# EAGLE schematic IR Thermometer (EAGLE 7.6.0)
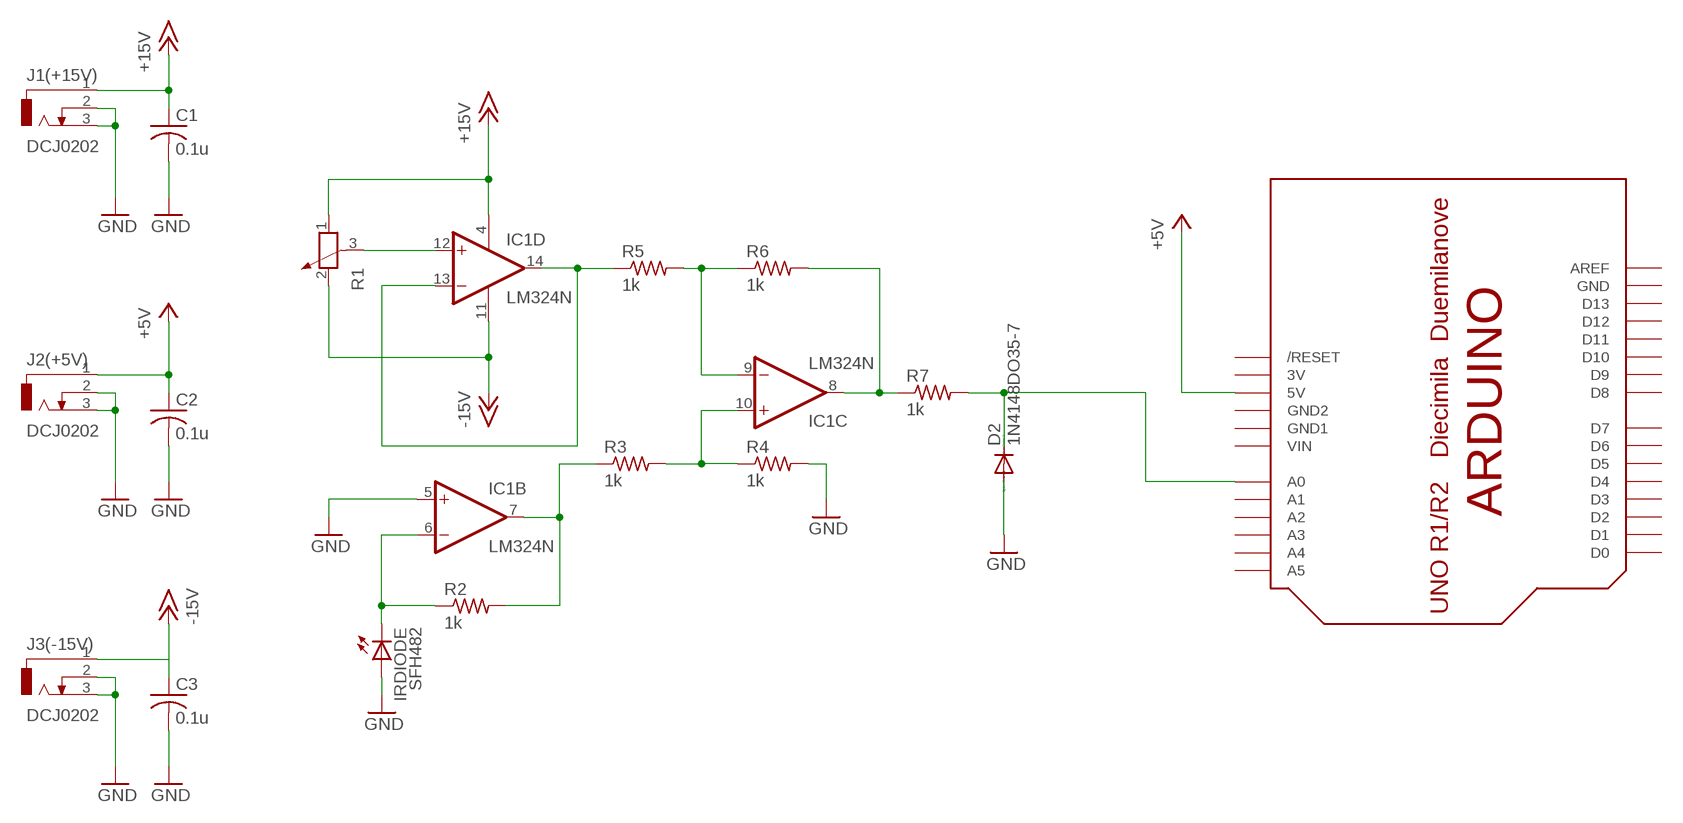
[diagram p0: schematic, sheet 1]

## Parts
C1  0.1u  C-USC0805  [C0805]
C2  0.1u  C-USC0805  [C0805]
C3  0.1u  C-USC0805  [C0805]
D2  1N4148DO35-7  [DO35-7]
IC1  LM324N  [DIL14]
IRDIODE  SFH482  [SFH482]
J1(+15V)  DCJ0202  [DCJ0202]
J2(+5V)  DCJ0202  [DCJ0202]
J3(-15V)  DCJ0202  [DCJ0202]
R1  POTENTIOMETER_PT-10  [PT-10]
R2  1k  R-US_M0805  [M0805]
R3  1k  R-US_M0805  [M0805]
R4  1k  R-US_M0805  [M0805]
R5  1k  R-US_M0805  [M0805]
R6  1k  R-US_M0805  [M0805]
R7  1k  R-US_M0805  [M0805]
U$1  ARDUINOUNO  [ARDUINO]

## Nets
+5V: C2.1 J2(+5V).1 U$1.5V
+15V: C1.1 IC1.4(P:V+) J1(+15V).1 R1.1
-15V: C3.1 IC1.11(P:V-) J3(-15V).1 R1.2
GND: C1.2 C2.2 C3.2 D2.A IC1.5(B:+IN) IRDIODE.A J1(+15V).2 J1(+15V).3 J2(+5V).2 J2(+5V).3 J3(-15V).2 J3(-15V).3 R4.2
N$3: IC1.6(B:-IN) IRDIODE.K(C) R2.1
N$4: IC1.7(B:OUT) R2.2 R3.1
N$5: IC1.10(C:+IN) R3.2 R4.1
N$6: IC1.9(C:-IN) R5.2 R6.1
N$7: IC1.13(D:-IN) IC1.14(D:OUT) R5.1
N$8: IC1.8(C:OUT) R6.2 R7.1
N$9: D2.C R7.2 U$1.A0
N$10: IC1.12(D:+IN) R1.3
Unconnected: IC1.1(A:OUT) IC1.2(A:-IN) IC1.3(A:+IN) U$1.A1 U$1.A2 U$1.A3 U$1.A4 U$1.A5 U$1.AREF U$1.D0 U$1.D1 U$1.D2 U$1.D3 U$1.D4 U$1.D5 U$1.D6 U$1.D7 U$1.D8 U$1.D9 U$1.D10 U$1.D11 U$1.D12 U$1.D13 U$1.RESET(/RESET)

## Power pins joined to a net without a drawn wire
3V: U$1.3V
GND: U$1.GND
GND1: U$1.GND1
GND2: U$1.GND2
VIN: U$1.VIN

## Library data of the parts
C1-C3 = resistor:C-US: CAPACITOR, American symbol
D2 = diode:1N4148: DIODE high speed (Philips)
IC1 = linear:LM324: OP AMP
IRDIODE = led:SFH482: IR LED infrared emitting diode, Infineon
J1(+15V) J2(+5V) J3(-15V) = con-jack:DCJ0202: DC POWER JACK Source: DCJ0202.pdf; OC_FARNELL: unknown; OC_NEWARK: unknown
R1 = rcl:POTENTIOMETER_: Potentiometer
R2-R7 = resistor:R-US_: RESISTOR, American symbol
U$1 = adafruit:ARDUINO: Arduino Diecimila/Duemilanove Make a shield with ease, this package has all the named pins as well as the two mounting drill holes and an outline of the USB and DC power connector. The outline is on the DIMENSION layer, so if your board house uses it they will cut the outline to match. http://www.ladyada.net/library/pcb/eaglelibrary.html

## Net classes
0 default: width 0.305 mm, drill 0.508 mm, clearance 0.254 mm